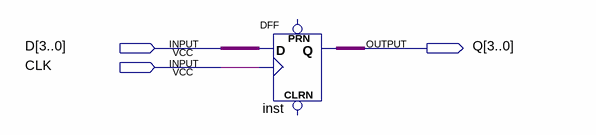
[diagram p0: schematic sheet]
// Quartus schematic DFFs.bdf as structural Verilog: 1 symbols, 3 pins
module DFFs (
  input  [3:0] D,
  input  CLK,
  output [3:0] Q
);

  DFF inst[3:0] (.CLK(CLK), .D(D), .Q(Q));  // open: CLRN, PRN
endmodule
